# EAGLE design Płytka (EAGLE 9.5.1)
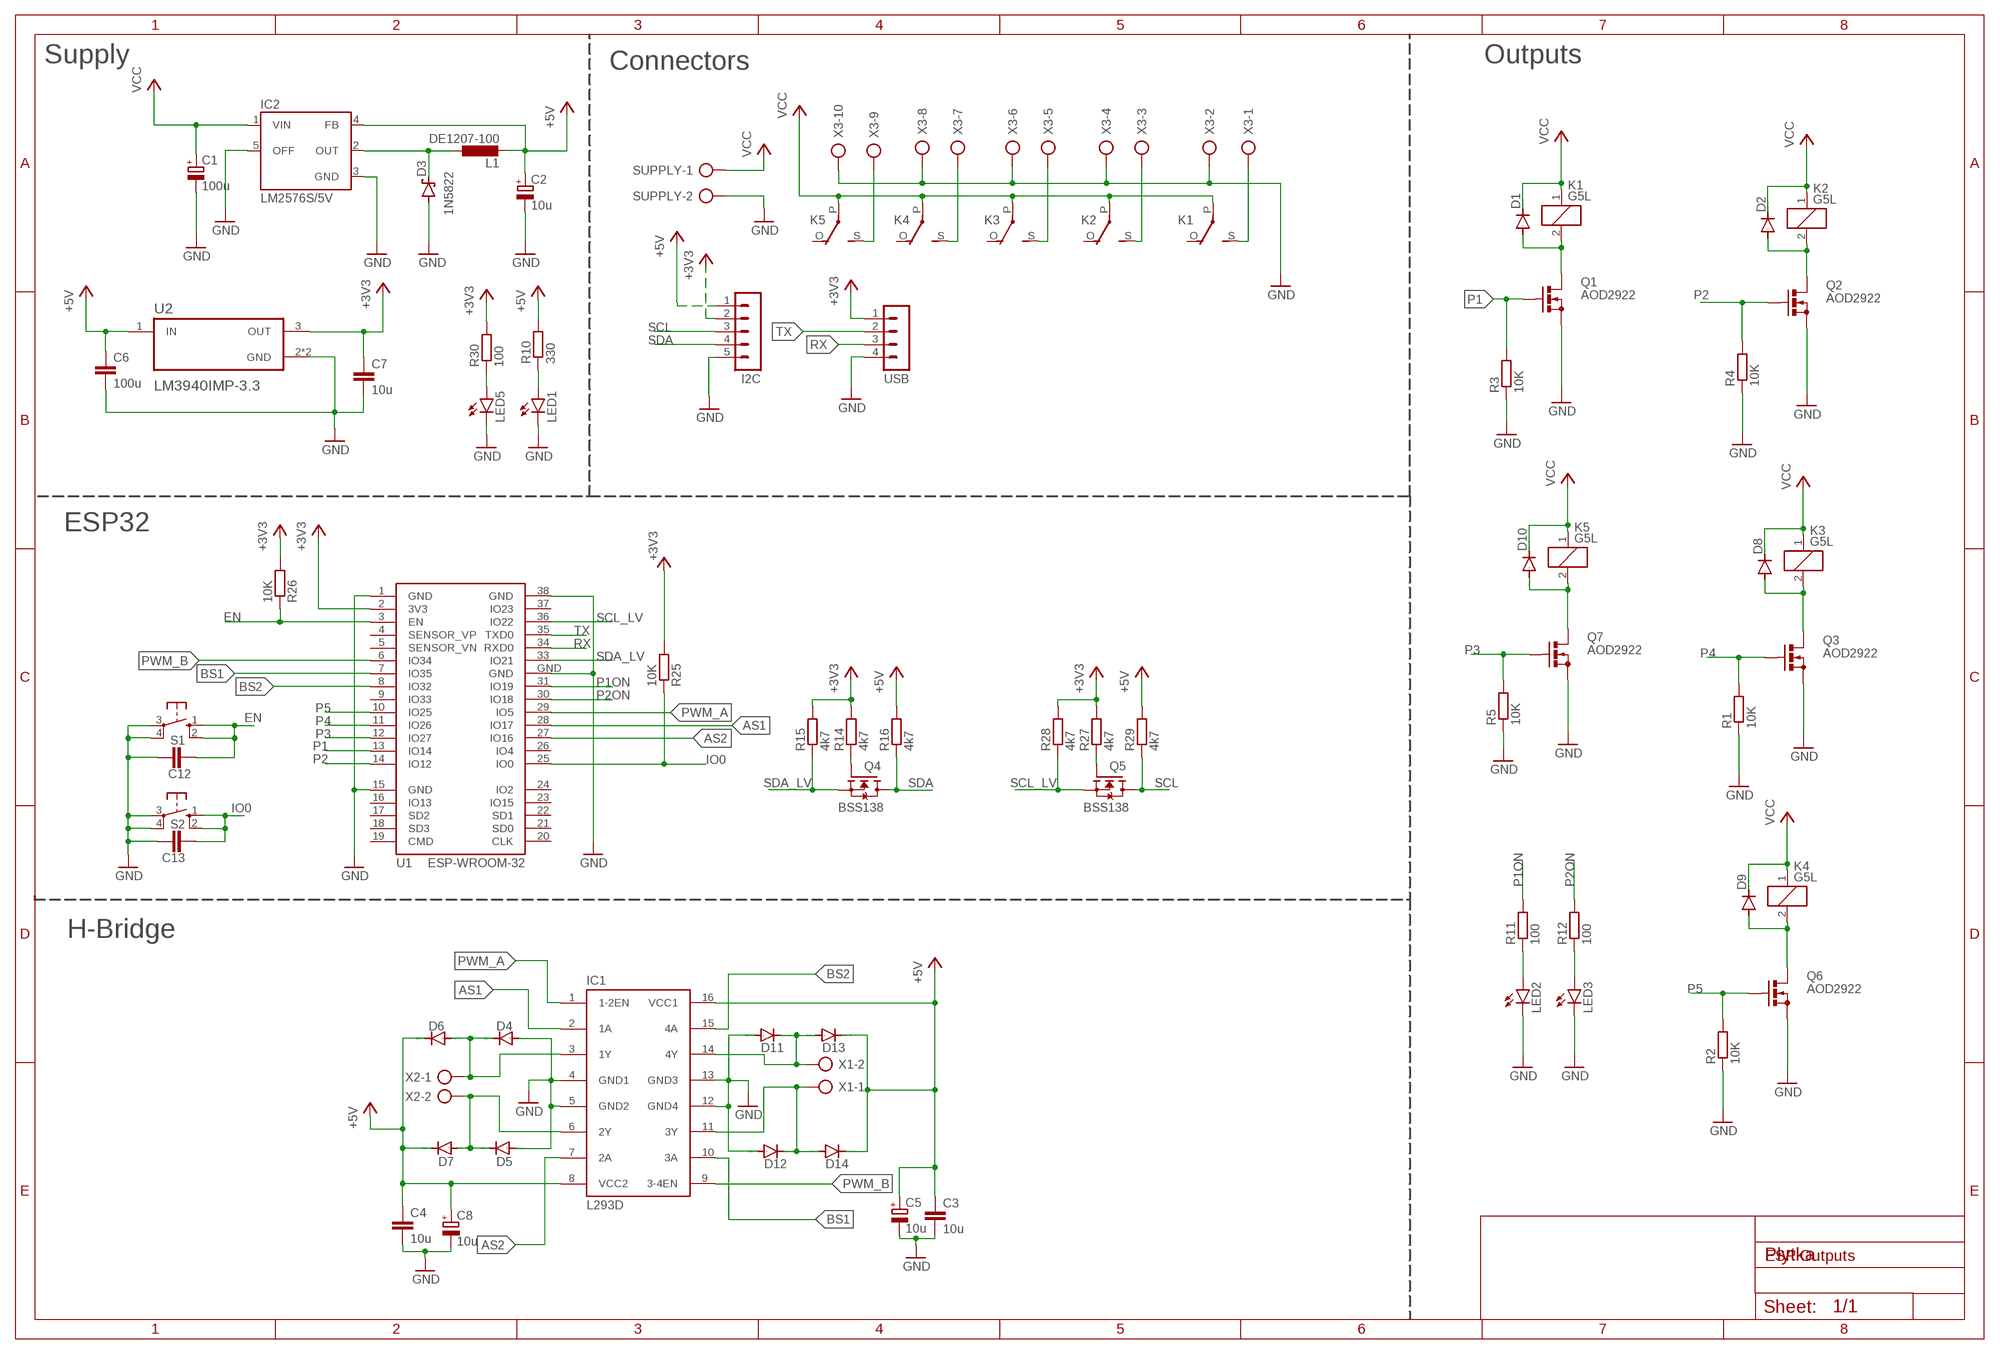
[diagram p0: schematic, sheet 1]

## Parts
C1  100u  CPOL-EUE2.5-6  [E2,5-6]
C2  10u  CPOL-EUE3.5-8  [E3,5-8]
C3  10u  C-EUC0805K  [C0805K]
C4  10u  C-EUC0805K  [C0805K]
C5  10u  CPOL-EUE5-8.5  [E5-8,5]
C6  100u  C-EUC0805K  [C0805K]
C7  10u  C-EUC0805K  [C0805K]
C8  10u  CPOL-EUE5-8.5  [E5-8,5]
C12  C-EUC0805K  [C0805K]
C13  C-EUC0805K  [C0805K]
D1  DIODE-DO214AC  [DO214AC]
D2  DIODE-DO214AC  [DO214AC]
D3  1N5822  1N5908  [C4111-15]
D4  DIODE-DO214AC  [DO214AC]
D5  DIODE-DO214AC  [DO214AC]
D6  DIODE-DO214AC  [DO214AC]
D7  DIODE-DO214AC  [DO214AC]
D8  DIODE-DO214AC  [DO214AC]
D9  DIODE-DO214AC  [DO214AC]
D10  DIODE-DO214AC  [DO214AC]
D11  DIODE-DO214AC  [DO214AC]
D12  DIODE-DO214AC  [DO214AC]
D13  DIODE-DO214AC  [DO214AC]
D14  DIODE-DO214AC  [DO214AC]
I2C  MA05-1  [MA05-1]
IC1  L293D  [DIL16]
IC2  LM2576S/5V  LM2576T  [TO220-5]
K1  G5L  [G5LE]
K2  G5L  [G5LE]
K3  G5L  [G5LE]
K4  G5L  [G5LE]
K5  G5L  [G5LE]
L1  DE1207-100  [DE1207]
LED1  LEDSML0805  [SML0805]
LED2  LEDSML0805  [SML0805]
LED3  LEDSML0805  [SML0805]
LED5  LEDSML0805  [SML0805]
Q1  AOD2922  MOSFET_NIXTY8N65X2  [TO252AA]
Q2  AOD2922  MOSFET_NIXTY8N65X2  [TO252AA]
Q3  AOD2922  MOSFET_NIXTY8N65X2  [TO252AA]
Q4  BSS138  [SOT23]
Q5  BSS138  [SOT23]
Q6  AOD2922  MOSFET_NIXTY8N65X2  [TO252AA]
Q7  AOD2922  MOSFET_NIXTY8N65X2  [TO252AA]
R1  10K  R-EU_R0805  [R0805]
R2  10K  R-EU_R0805  [R0805]
R3  10K  R-EU_R0805  [R0805]
R4  10K  R-EU_R0805  [R0805]
R5  10K  R-EU_R0805  [R0805]
R10  330  R-EU_R0805  [R0805]
R11  100  R-EU_R0805  [R0805]
R12  100  R-EU_R0805  [R0805]
R14  4k7  R-EU_R0805  [R0805]
R15  4k7  R-EU_R0805  [R0805]
R16  4k7  R-EU_R0805  [R0805]
R25  10K  R-EU_R0805  [R0805]
R26  10K  R-EU_R0805  [R0805]
R27  4k7  R-EU_R0805  [R0805]
R28  4k7  R-EU_R0805  [R0805]
R29  4k7  R-EU_R0805  [R0805]
R30  100  R-EU_R0805  [R0805]
S1  10-XX  [B3F-10XX]
S2  10-XX  [B3F-10XX]
SUPPLY  AK500/2-H  [AK500/2-H]
U1  ESP-WROOM-32  [ESP-WROOM-32]
U2  LM3940IMP-3.3  [SOT230P700X180-4N]
USB  MA04-1  [MA04-1]
X1  AK500/2  [AK500/2]
X2  AK500/2  [AK500/2]
X3  AK500/10  [AK500/10]

## Nets
+3V3: C7.1 I2C.2 R14.2 R15.2 R25.2 R26.2 R27.2 R28.2 R30.2 U1.2(3V3) U2.3(OUT) USB.1
+5V: C2.+ C3.1 C4.1 C5.+ C6.1 C8.+ D6.C D7.C D13.C D14.C I2C.1 IC1.8(VCC2) IC1.16(VCC1) IC2.4(FB) L1.2 R10.2 R16.2 R29.2 U2.1(IN)
AS1: IC1.2(1A) U1.28(IO17)
AS2: IC1.7(2A) U1.27(IO16)
BS1: IC1.10(3A) U1.7(IO35)
BS2: IC1.15(4A) U1.8(IO32)
EN: C12.2 R26.1 S1.1(S) S1.2(S1) U1.3(EN)
GND: C1.- C2.- C3.2 C4.2 C5.- C6.2 C7.2 C8.- C12.1 C13.1 D3.A D4.A D5.A D11.A D12.A I2C.5 IC1.4(GND1) IC1.5(GND2) IC1.12(GND4) IC1.13(GND3) IC2.3(GND) IC2.5(OFF) LED1.C LED2.C LED3.C LED5.C Q1.2(S) Q2.2(S) Q3.2(S) Q6.2(S) Q7.2(S) R1.1 R2.1 R3.1 R4.1 R5.1 S1.3(P) S1.4(P1) S2.3(P) S2.4(P1) SUPPLY.2 U1.1(GND) U1.15(GND) U1.38(GND) U1.GND U2.2(GND) U2.4(GND) USB.4 X3.2 X3.4 X3.6 X3.8 X3.10
IO0: C13.2 R25.1 S2.1(S) S2.2(S1) U1.25(IO0)
N$1: K5.S(2:S) X3.9
N$2: D8.A K3.2 Q3.3(D)
N$3: LED1.A R10.1
N$4: Q4.1(G) R14.1
N$5: LED2.A R11.1
N$6: LED3.A R12.1
N$7: K4.S(2:S) X3.7
N$8: Q5.1(G) R27.1
N$9: K3.S(2:S) X3.5
N$10: K2.S(2:S) X3.3
N$11: D9.A K4.2 Q6.3(D)
N$12: D1.A K1.2 Q1.3(D)
N$13: D2.A K2.2 Q2.3(D)
N$14: K1.S(2:S) X3.1
N$16: D10.A K5.2 Q7.3(D)
N$18: D4.C D6.A IC1.3(1Y) X2.1
N$19: D3.C IC2.2(OUT) L1.1
N$20: D12.C D14.A IC1.11(3Y) X1.1
N$21: D11.C D13.A IC1.14(4Y) X1.2
N$23: LED5.A R30.1
N$24: D5.C D7.A IC1.6(2Y) X2.2
P1: Q1.1(G) R3.2 U1.13(IO14)
P1ON: R11.2 U1.31(IO19)
P2: Q2.1(G) R4.2 U1.14(IO12)
P2ON: R12.2 U1.30(IO18)
P3: Q7.1(G) R5.2 U1.12(IO27)
P4: Q3.1(G) R1.2 U1.11(IO26)
P5: Q6.1(G) R2.2 U1.10(IO25)
PWM_A: IC1.1(1-2EN) U1.29(IO5)
PWM_B: IC1.9(3-4EN) U1.6(IO34)
RX: U1.34(RXD0) USB.3
SCL: I2C.3 Q5.3(D) R29.1
SCL_LV [U1]: Q5.2(S) R28.1 U1.36(IO22)
SDA: I2C.4 Q4.3(D) R16.1
SDA_LV [U1]: Q4.2(S) R15.1 U1.33(IO21)
TX: U1.35(TXD0) USB.2
VCC: C1.+ D1.C D2.C D8.C D9.C D10.C IC2.1(VIN) K1.1 K1.P(2:P) K2.1 K2.P(2:P) K3.1 K3.P(2:P) K4.1 K4.P(2:P) K5.1 K5.P(2:P) SUPPLY.1
Unconnected: K1.O(2:O) K2.O(2:O) K3.O(2:O) K4.O(2:O) K5.O(2:O) U1.4(SENSOR_VP) U1.5(SENSOR_VN) U1.9(IO33) U1.16(IO13) U1.17(SD2) U1.18(SD3) U1.19(CMD) U1.20(CLK) U1.21(SD0) U1.22(SD1) U1.23(IO15) U1.24(IO2) U1.26(IO4) U1.37(IO23)

## Notes on the sheet
- Supply | Connectors | Outputs
- ESP32
- H-Bridge
- ESP Outputs

## Library data of the parts
C1 C2 = rcl:CPOL-EU: POLARIZED CAPACITOR, European symbol; SPICEPREFIX: C
C3 C4 = resistor:C-EU: CAPACITOR, European symbol
C5 C8 = resistor:CPOL-EU: POLARIZED CAPACITOR, European symbol
C6 C7 C12 C13 = rcl:C-EU: CAPACITOR, European symbol; SPICEPREFIX: C
D1 D2 D4-D14 = diode:DIODE-: DIODE
D3 = diode:1N5908: DIODE schottky
I2C = con-lstb:MA05-1: PIN HEADER; OC_FARNELL: unknown; OC_NEWARK: unknown
IC1 = st-microelectronics:L293D: PUSH-PULL 4 CHANNEL DRIVER
IC2 = v-reg-3:LM2576: National Semiconductor <http://www.national.com> 3.0A "Simple Switcher"(c) 52kHz, Vout 1.23-37V (HV: 57V), Vin 40V (HV: 60V), 50µA standby current
K1-K5 = relay:G5L: RELAY 1 x switch, 10 A/120 V AC, 8 A/30 V ADC, Omron; OC_FARNELL: unknown; OC_NEWARK: unknown
L1 = ferrocore:DE1207-100: SMD power coil 100 uH
LED1-LED3 LED5 = led:LED: LED OSRAM: - CHIPLED LG R971, LG N971, LY N971, LG Q971, LY Q971, LO R971, LY R971 LH N974, LH R974 LS Q976, LO Q976, LY Q976 LO Q996 - Hyper CHIPLED LW Q18S LB Q993, LB Q99A, LB R99A - SideLED LS A670, LO A670, LY A670, LG A670, LP A670 LB A673, LV A673, LT A673, LW A673 LH A674 LY A675 LS A676, LA A676, LO A676, LY A676, LW A676 LS A679, LY A679, LG A679 - Hyper Micro SIDELED® LS Y876, LA Y876, LO Y876, LY Y876 LT Y87S - SmartLED LW L88C, LW L88S LB L89C, LB L89S, LG L890 LS L89K, LO L89K, LY L89K LS L896, LA L896, LO L896, LY L896 - TOPLED LS T670, LO T670, LY T670, LG T670, LP T670 LSG T670, LSP T670, LSY T670, LOP T670, LYG T670 LG T671, LOG T671, LSG T671 LB T673, LV T673, LT T673, LW T673 LH T674 LS T676, LA T676, LO T676, LY T676, LB T676, LH T676, LSB T676, LW T676 LB T67C, LV T67C, LT T67C, LS T67K, LO T67K, LY T67K, LW E67C LS E67B, LA E67B, LO E67B, LY E67B, LB E67C, LV E67C, LT E67C LW T67C LS T679, LY T679, LG T679 LS T770, LO T770, LY T770, LG T770, LP T770 LB T773, LV T773, LT T773, LW T773 LH T774 LS E675, LA E675, LY E675, LS T675 LS T776, LA T776, LO T776, LY T776, LB T776 LHGB T686 LT T68C, LB T68C - Hyper Mini TOPLED® LB M676 - Mini TOPLED Santana® LG M470 LS M47K, LO M47K, LY M47K Source: http://www.osram.convergy.de LUXEON: - LUMILED® LXK2-PW12-R00, LXK2-PW12-S00, LXK2-PW14-U00, LXK2-PW14-V00 LXK2-PM12-R00, LXK2-PM12-S00, LXK2-PM14-U00 LXK2-PE12-Q00, LXK2-PE12-R00, LXK2-PE12-S00, LXK2-PE14-T00, LXK2-PE14-U00 LXK2-PB12-K00, LXK2-PB12-L00, LXK2-PB12-M00, LXK2-PB14-N00, LXK2-PB14-P00, LXK2-PB14-Q00 LXK2-PR12-L00, LXK2-PR12-M00, LXK2-PR14-Q00, LXK2-PR14-R00 LXK2-PD12-Q00, LXK2-PD12-R00, LXK2-PD12-S00 LXK2-PH12-R00, LXK2-PH12-S00 LXK2-PL12-P00, LXK2-PL12-Q00, LXK2-PL12-R00 Source: www.luxeon.com KINGBRIGHT: KA-3528ASYC Source: www.kingbright.com
Q1-Q3 Q6 Q7 = Clean-Kong:MOSFET_N: SC70FL MOSFET Canal N, 20V 2A RS920-9805 Canal N : 3=S 2=G 1=D
Q4 Q5 = bss138_10:BSS138: BSS138 N-Channel Logic Level Enhancement Mode Field Effect Transistor Source: http://www.fairchildsemi.com/datasheets/BS/BSS138.pdf; MF: Fairchild; MPN: BSS138; OC_FARNELL: 9845330; OC_NEWARK: 67R2009
R1-R5 R10-R12 R14-R16 R25-R30 = rcl:R-EU_: RESISTOR, European symbol; SPICEPREFIX: R
S1 S2 = switch-omron:10-XX: OMRON SWITCH; MPN: B3F-1000; OC_FARNELL: 176432; OC_NEWARK: 36M3542
SUPPLY = con-ptr500:AK500/2-H: CONNECTOR Aug. 2004 / PTR Meßtechnik: Die Bezeichnung der Serie AK505 wurde geändert. Es handelt sich hierbei um AK500 in horizontaler Ausführung.; OC_FARNELL: unknown; OC_NEWARK: unknown
U1 = esp32:ESP-WROOM-32: Espressif Systems ESP-WROOM-32
U2 = LM3940IMP-3.3:LM3940IMP-3.3: Check prices <https://pricing.snapeda.com/search/part/LM3940IMP-3.3/?ref=eda>; AVAILABILITY: Warning; DESCRIPTION: 1-A, low-dropout voltage regulator for 5-V to 3.3-V conversion 4-SOT-223 -40 to 125; MF: Texas Instruments; MP: LM3940IMP-3.3; PACKAGE: SOT-223-4 Texas Instruments; PRICE: None; PURCHASE-URL: https://pricing.snapeda.com/search/part/LM3940IMP-3.3/?ref=eda
USB = con-lstb:MA04-1: PIN HEADER; OC_FARNELL: unknown; OC_NEWARK: unknown
X1 X2 = con-ptr500:AK500/2: CONNECTOR; OC_FARNELL: unknown; OC_NEWARK: unknown
X3 = con-ptr500:AK500/10: CONNECTOR; OC_FARNELL: unknown; OC_NEWARK: unknown

## Net classes
1 U1: width 0.203 mm

## Board
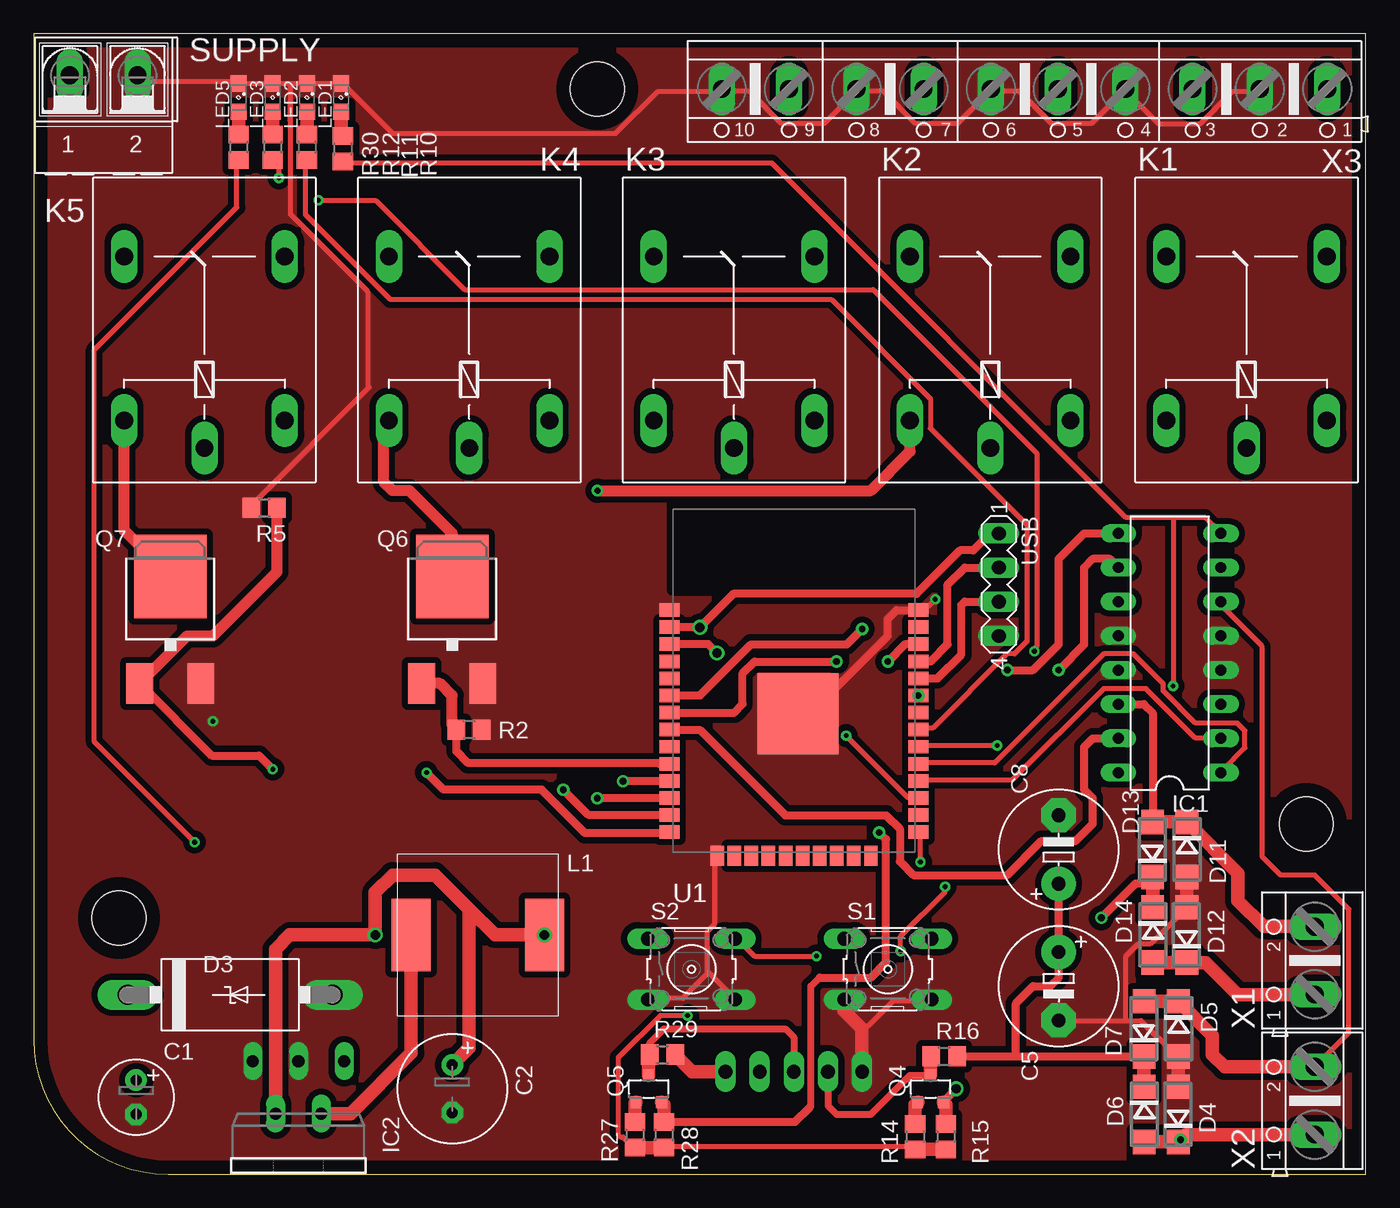
[diagram p1: board, top side]
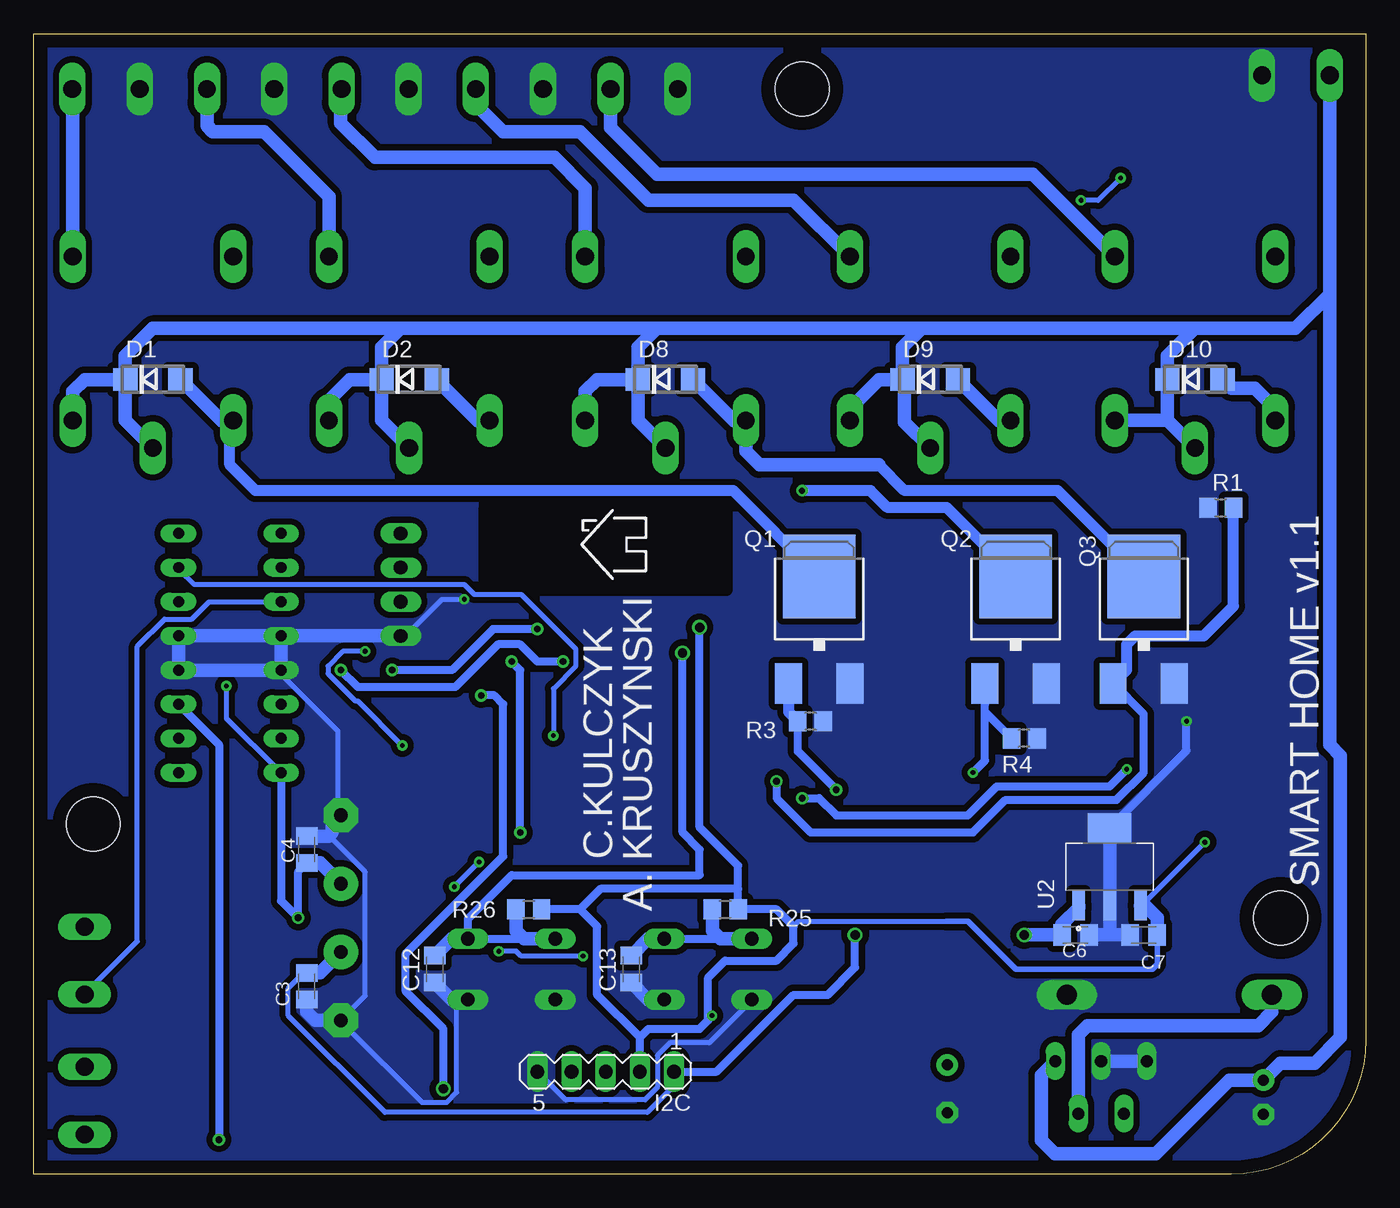
[diagram p2: board, bottom side, seen from below]

Size 99.04 x 84.76 mm. Coordinates in mm from the lower left corner, seen from the top.
Outline: 10,0 99.04,0 99.04,84.76 0,84.76 0,10 arc90 10,0
Copper layers (1*16): Top 0.035mm / dielectric 1.5mm / Bottom 0.035mm
Design rules "default *": minimum track width 14mil, minimum drill 0.35mm, track to track 15mil, track to pad 10mil, pad to pad 6mil, via to via 6mil, smd to smd 6mil, copper to edge 40mil, drill to drill 6mil, minimum pad ring 10mil, minimum via ring 8mil, stop-mask expansion 4mil, vias tented up to drill 0mil, thermal gap 10mil
Holes 4.01 mm at 41.91,80.64 94.61,26.04 6.35,19.05

### Footprints (pad centres in the part's own frame; a part is rotated, then mirrored left to right if it is on the bottom)
E2,5-6 = drill 0.813 pad 1.6: + -1.27,0 | drill 0.813 pad 1.6 octagon: - 1.27,0
E3,5-8 = drill 0.813 pad 1.6: + -1.778,0 | drill 0.813 pad 1.6 octagon: - 1.778,0
C0805K = smd 1.3 x 1.6: 1 -1,0; 2 1,0
E5-8,5 = drill 1.016 pad 2.54: + -2.54,0 | drill 1.016 pad 2.54 octagon: - 2.54,0
DO214AC = smd 1.8 x 1.7: A 2.05,0; C -2.05,0
C4111-15 = drill 1.499 long: A 7.62,0; C -7.62,0
MA05-1 = drill 1.016 long: 1 -5.08,0; 2 -2.54,0; 3 0,0; 4 2.54,0; 5 5.08,0
DIL16 = drill 0.813 long: 1 -8.89,-3.81; 2 -6.35,-3.81; 3 -3.81,-3.81; 4 -1.27,-3.81; 5 1.27,-3.81; 6 3.81,-3.81; 7 6.35,-3.81; 8 8.89,-3.81; 9 8.89,3.81; 10 6.35,3.81; 11 3.81,3.81; 12 1.27,3.81; 13 -1.27,3.81; 14 -3.81,3.81; 15 -6.35,3.81; 16 -8.89,3.81
TO220-5 = drill 0.9 long: 1 -3.4,-8.4; 2 -1.7,-4.5; 3 0,-8.4; 4 1.7,-4.5; 5 3.4,-8.4
G5LE = drill 1.321 long: 1 -7.493,-5.969; 2 -7.493,5.969; O 4.699,5.969; P -9.525,0; S 4.699,-5.969
DE1207 = smd 2.9 x 5.4: 1 -4.95,0; 2 4.95,0
SML0805 = smd 1.2 x 1.2: A 1.05,0; C -1.05,0
TO252AA = smd 2 x 3: 1 -2.28,-2.895; 2 2.28,-2.895 | smd 5.4 x 6.2: 3 0,5.04
SOT23 = smd 0.8 x 0.9: 1 -0.95,-1; 2 0.95,-1; 3 0,1
R0805 = smd 1.3 x 1.5: 1 -0.95,0; 2 0.95,0
B3F-10XX = drill 1.016 long: 1 -3.251,2.261; 2 3.251,2.261; 3 -3.251,-2.261; 4 3.251,-2.261
AK500/2-H = drill 1.321 long: 1 -2.515,0; 2 2.515,0
ESP-WROOM-32 = smd 1.5 x 1: 1 -9.25,7; 2 -9.25,5.73; 3 -9.25,4.46; 4 -9.25,3.19; 5 -9.25,1.92; 6 -9.25,0.65; 7 -9.25,-0.62; 8 -9.25,-1.89; 9 -9.25,-3.16; 10 -9.25,-4.43; 11 -9.25,-5.7; 12 -9.25,-6.97; 13 -9.25,-8.24; 14 -9.25,-9.51; 25 9.25,-9.51; 26 9.25,-8.24; 27 9.25,-6.97; 28 9.25,-5.7; 29 9.25,-4.43; 30 9.25,-3.16; 31 9.25,-1.89; 32 9.25,-0.62; 33 9.25,0.65; 34 9.25,1.92; 35 9.25,3.19; 36 9.25,4.46; 37 9.25,5.73; 38 9.25,7 | smd 1 x 1.5: 15 -5.7,-11.25; 16 -4.43,-11.25; 17 -3.16,-11.25; 18 -1.89,-11.25; 19 -0.62,-11.25; 20 0.65,-11.25; 21 1.92,-11.25; 22 3.19,-11.25; 23 4.46,-11.25; 24 5.73,-11.25 | smd 6 x 6: GND 0.3,-0.7
SOT230P700X180-4N = smd 2.15 x 0.95: 1 -2.9,2.3; 2 -2.9,0; 3 -2.9,-2.3 | smd 2.15 x 3.25: 4 2.9,0
MA04-1 = drill 1.016 long: 1 -3.81,0; 2 -1.27,0; 3 1.27,0; 4 3.81,0
AK500/2 = drill 1.321 long: 1 -2.515,0; 2 2.515,0
AK500/10 = drill 1.321 long: 1 -22.504,0; 2 -17.501,0; 3 -12.497,0; 4 -7.493,0; 5 -2.489,0; 6 2.489,0; 7 7.493,0; 8 12.497,0; 9 17.501,0; 10 22.504,0

### Placement (x,y rotation side)
C1  7.62,5.71 270 top
C2  31.11,6.35 270 top
C3  78.74,13.97 270 bottom
C4  78.74,24.13 90 bottom
C5  76.2,13.97 270 top
C6  21.59,17.78 0 bottom
C7  16.51,17.78 180 bottom
C8  76.2,24.13 90 top
C12  69.22,15.24 90 bottom
C13  54.61,15.24 90 bottom
D1  90.17,59.05 0 bottom
D2  71.12,59.05 0 bottom
D3  14.61,13.34 0 top
D4  85.09,4.45 90 top
D5  85.09,10.79 270 top
D6  82.55,4.45 270 top
D7  82.55,10.79 90 top
D8  52.07,59.05 0 bottom
D9  32.38,59.05 0 bottom
D10  12.7,59.05 0 bottom
D11  85.72,24.13 270 top
D12  85.72,17.78 90 top
D13  83.19,24.13 90 top
D14  83.19,17.78 270 top
I2C  56.52,7.62 180 bottom
IC1  84.45,38.73 90 top
IC2  19.68,0 180 top
K1  90.17,63.5 90 top
K2  71.12,63.5 90 top
K3  52.07,63.5 90 top
K4  32.38,63.5 90 top
K5  12.7,63.5 90 top
L1  33.02,17.78 0 top
LED1  22.86,80.01 270 top
LED2  20.32,80.01 270 top
LED3  17.78,80.01 270 top
LED5  15.24,80.01 270 top
Q1  40.64,39.37 0 bottom
Q2  26.04,39.37 0 bottom
Q3  16.51,39.37 0 bottom
Q4  66.67,6.35 0 top
Q5  45.72,6.35 0 top
Q6  31.11,39.37 0 top
Q7  10.16,39.37 0 top
R1  10.79,49.53 0 bottom
R2  32.38,33.02 180 top
R3  41.27,33.66 180 bottom
R4  25.4,32.38 180 bottom
R5  17.14,49.53 0 top
R10  22.99,76.2 270 top
R11  20.32,76.33 270 top
R12  17.78,76.33 270 top
R14  65.53,2.79 270 top
R15  67.82,2.79 270 top
R16  67.69,8.76 0 top
R25  47.62,19.68 0 bottom
R26  62.23,19.68 0 bottom
R27  44.7,2.92 270 top
R28  46.86,2.92 270 top
R29  46.74,8.89 0 top
R30  15.24,76.33 270 top
S1  63.5,15.24 0 top
S2  48.9,15.24 0 top
SUPPLY  5.21,81.66 0 top
U1  56.52,34.92 0 top
U2  19.05,22.86 90 bottom
USB  71.75,43.81 270 top
X1  95.25,15.88 90 top
X2  95.25,5.46 90 top
X3  73.66,80.64 180 top

### Tracks (layer width: path | path; a pad name or v marks a point on that pad's centre or on a via)
+3V3  (via drill 0.35, 0.7)
  Top 0.356: R28.2 47.33,2.03 65.19,2.03 R14.2 | v48.62,11.79 46.59,11.79 43.46,8.65 43.46,2.95 43.64,2.76 43.83,2.76 44.38,2.21 R27.2 | v11.97,24.68 4.52,32.12 4.52,61.27 15.1,71.84 15.1,75.32 R30.2
  Top 0.61: USB.1 71.12,47.62 69.85,46.35 68.88,46.35 65.64,43.12 52.01,43.12 v49.53,40.64 47.28,40.64 U1.2
  Top 1.016: R27.2 R28.2 | R14.2 R15.2
  Bottom 0.356: v48.62,11.79 48.9,11.79 | v11.97,24.68 16.2,20.44 16.4,19.96 | 31.19,18.78 42.16,18.78 42.55,18.41
  Bottom 0.406: 31.19,18.78 29.58,18.78 26.04,15.24 15.88,15.24 15.51,15.61 C7.1
  Bottom 0.61: I2C.2 53.98,10.16 | 58.42,19.68 57.15,18.41 57.15,13.34 53.98,10.16 | 58.42,19.68 R26.2 | 53.98,10.16 53.34,10.79 49.53,10.79 48.9,11.43 48.9,11.79 48.9,14.61 47.62,15.88 43.81,15.88 42.55,17.14 42.55,18.41 43.81,19.68 R25.2 46.67,21.21 | 46.67,21.21 46.67,22.93 49.53,25.78 v49.53,40.64 | 46.67,21.21 56.9,21.21 58.42,19.68
  Bottom 1.016: C7.1 15.51,19.07 16.4,19.96 U2.3
+5V  (via drill 0.35, 0.5, 0.7)
  Top 0.356: 84.71,48.8 87.1,48.8 88.21,47.7 IC1.8 | 84.71,48.8 81.21,48.8 54.88,75.13 23.02,75.13 R10.2 | 84.71,48.8 v84.71,36.28
  Top 0.61: R16.2 73.03,8.76 | 73.03,8.76 82.53,8.76 D7.C | 73.03,8.76 73.03,12.7 74.3,13.97 75.56,13.97 76.2,14.61 C5.+ C8.+ | D13.C 82.69,21.59 81.92,21.59 v79.38,19.05
  Top 1.016: D6.C D7.C | D14.C D13.C | 32.38,19.68 29.84,22.23 26.67,22.23 25.4,20.95 v25.4,17.78 19.05,17.78 17.98,16.71 IC2.4 | 32.38,19.68 34.29,17.78 L1.2 | R29.2 48.96,7.62 I2C.1 | C2.+ 32.38,9.4 32.38,19.68
  Bottom 0.356: C3.1 79.18,14.73 80.11,13.81 80.11,11.79 72.92,4.6 53.4,4.6 51.56,6.45 51.56,7.37 I2C.1 | v84.71,36.28 84.71,33.88 80.84,30.02 IC1.16
  Bottom 0.61: I2C.1 48.26,7.62 42.55,13.34 40.01,13.34 37.97,15.37 L1.2 | IC1.16 80.64,20.32 v79.38,19.05 79.38,22.5 C4.1
  Bottom 1.016: C8.+ 77.74,23.13 C4.1 | C5.+ 77.74,14.97 C3.1 | U2.1 21.35,19.8 22.59,18.56 C6.1 v25.4,17.78
  other vias: 37.97,17.78
AS1
  Top 0.356: U1.28 65.93,29.28 72.74,29.28 79.55,36.09 82.68,36.09 86.37,32.41 88.21,32.41 IC1.2
AS2  (via drill 0.35)
  Top 0.356: v60.4,32.59 65,27.99 65.74,27.99 U1.27
  Bottom 0.356: v60.4,32.59 60.4,36.09 58.74,37.75 58.74,39.04 62.8,43.09 66.29,43.09 67.03,43.83 87.1,43.83 88.21,44.93 IC1.7
BS1  (via drill 0.5)
  Top 0.61: U1.7 52.09,34.3 52.7,34.92 52.7,37.21 53.59,38.1 v59.69,38.1 | v76.2,37.47 78.11,39.37 78.11,45.09 78.74,45.72 80.01,45.72 IC1.10
  Bottom 0.61: v59.69,38.1 61.59,38.1 62.87,39.37 64.52,39.37 67.69,36.2 74.93,36.2 v76.2,37.47
BS2
  Top 0.61: U1.8 49.53,33.02 55.88,26.67 63.37,26.67 64.39,25.65 64.39,23.24 65.41,22.23 72.39,22.23 74.93,24.77 77.47,24.77 78.74,26.04 78.74,27.94 78.11,28.57 78.11,31.75 78.74,32.38 IC1.15
EN  (via drill 0.7)
  Top 0.61: U1.3 50.15,39.38 v50.8,38.73
  Bottom 0.61: 62.59,17.5 S1.2 66.75,18.97 63.5,22.23 49.53,22.23 49.53,24.13 50.8,25.4 v50.8,38.73
  Bottom 1.016: C12.2 67.95,17.5 S1.2 | R26.1 63.18,18.09 62.59,17.5 S1.1
GND  (via drill 0.35)
  Top 0.356: S1.4 66.66,12.89 63.9,12.89 62.06,11.05 61.59,10.79 | 81.21,11.42 76.24,11.42 C5.- | 81.21,11.42 82.31,11.42 84.71,9.02 D5.A | 81.21,11.42 81.21,16.2 82.13,17.13 83.05,17.13 85.45,19.52 D12.A | v67.03,42.72 66.48,42.17 65.93,42.17 U1.38 | 50.18,15.01 52.11,13.07 S2.4 | 50.18,15.01 50.09,15.1 50.09,18.05 50.64,18.6 50.64,23.57 U1.15 | 50.18,15.01 48.25,13.07 45.67,13.07 S2.3 45.48,12.89 | X3.2 91.15,80.47 89.13,80.47 86.73,78.08 83.6,78.08 81.21,80.47 X3.4 81.03,80.47 78.63,78.08 75.69,78.08 73.29,80.47 71.27,80.47 X3.6 71.08,80.47 68.69,78.08 65.56,78.08 63.16,80.47 61.32,80.47 X3.8 61.14,80.47 58.74,78.08 55.61,78.08 53.22,80.47 51.19,80.47 X3.10 51.01,80.47 46.41,80.47 43.27,77.34 26.7,77.34 23.02,81.03 LED1.C 22.84,81.03 20.44,81.03 LED2.C 20.26,81.03 19.09,81.03 | 19.09,81.03 17.86,81.03 LED3.C 17.68,81.03 15.28,81.03 LED5.C 15.1,81.21 8.1,81.21 7.73,81.58 SUPPLY.2 | R5.1 16.39,49.91 24.95,58.47 24.86,58.56 24.86,65.57 19.09,71.34 19.09,81.03
  Top 0.61: U1.GND 57.72,34.23 63.5,40.01 63.5,41.27 64.15,41.92 U1.38
  Top 1.016: D4.A D5.A | D12.A D11.A | I2C.5 61.59,10.79 60.25,12.14 S1.3
  Bottom 0.356: C8.- 76.42,27.07 76.42,32.96 80.47,37.01 IC1.13 | S1.4 67.58,12.52 67.58,6.08 68.32,5.34 70.16,5.34 75.87,11.05 C5.- 75.87,11.79 74.4,13.26 74.4,22.47 76.79,24.86 77.11,25.13 | v67.03,42.72 68.69,42.72 71.27,40.15 USB.4 | I2C.5 61.51,7.55 59.48,5.52 53.59,5.52 52.67,6.45 52.67,8.84 51.75,9.76 48.8,9.76 45.67,12.89 S2.3 | 18.6,25.96 U2.4
  Bottom 0.61: U2.4 13.34,31.48 v13.34,33.66
  Bottom 1.016: C8.- 76.83,26.04 76.83,25.4 77.11,25.13 C4.2 | C5.- 78.11,11.43 78.74,12.06 C3.2 | C12.1 67.95,12.98 S1.4 | C13.1 53.35,12.98 S2.4 | C7.2 19.05,17.78 | 19.05,17.78 C6.2 | 19.05,17.78 U2.2 U2.4 | IC1.12 IC1.13 IC1.4 IC1.5 IC1.12 | IC1.12 USB.4 | IC2.3 IC2.5
  pour Bottom (isolate 0.457, no thermals): -14.61,99.06 -14.61,10.16 8.26,-12.7 97.79,-12.7 109.22,-1.27 109.22,90.81 100.97,99.06
  pour Top (isolate 0.457, no thermals): 34.29,103.5 10.79,103.5 -10.16,82.55 -10.16,6.35 6.99,-10.79 96.52,-10.79 97.16,-10.16 113.67,6.35 113.67,26.67 113.67,91.44 102.23,102.87 34.92,102.87
IO0  (via drill 0.35)
  Top 0.356: v65.93,23.2 65.93,25.41 U1.25 | v67.77,21.36 67.77,20.99 64.45,17.68 v64.45,16.57 | v58.19,16.2 53.59,16.2 52.3,17.49 S2.2
  Bottom 0.356: v67.77,21.36 v65.93,23.2 | v64.45,16.57 63.16,16.57 62.8,16.2 v58.19,16.2
  Bottom 0.61: S2.2 47.98,17.5
  Bottom 1.016: C13.2 53.35,17.5 S2.2 | R25.1 48.58,18.09 47.98,17.5 S2.1
N$1
  Bottom 1.016: K5.S 24.77,74.3 52.7,74.3 56.16,77.75 X3.9
N$2
  Bottom 0.813: Q3.3 22.9,50.8 34.29,50.8 36.2,52.7
  Bottom 1.016: D8.A 46.97,56.01 K3.2 46.1,53.72 45.09,52.7 36.2,52.7
N$3
  Top 1.016: R10.1 22.86,77.28 LED1.A
N$4
  Top 1.016: R14.1 65.53,5.16 Q4.1
N$5
  Top 1.016: R11.1 LED2.A
N$6
  Top 1.016: R12.1 LED3.A
N$7
  Bottom 1.016: K4.S 42.55,72.39 53.34,72.39 58.42,77.47 64.14,77.47 66.17,79.5 X3.7
N$8
  Top 1.016: R27.1 44.7,5.28 Q5.1
N$9
  Bottom 1.016: K3.S 58.04,73.28 60.33,75.56 73.66,75.56 76.2,78.11 76.2,80.59 X3.5
N$10
  Bottom 1.016: K2.S 77.09,72.64 81.92,77.47 85.72,77.47 86.16,77.9 X3.3
N$11
  Top 0.813: Q6.3 31.11,47.62 27.94,50.8 26.67,50.8 26.04,51.44 26.04,55.63 K4.2
  Bottom 1.016: D9.A 27.29,56.01 K4.2
N$12
  Bottom 0.813: Q1.3 47.03,50.8 82.55,50.8 84.45,52.7 84.45,55.75 K1.2
  Bottom 1.016: D1.A 85.07,56.01 K1.2
N$13  (via drill 0.45)
  Top 0.813: K2.2 65.15,53.72 62.23,50.8 v41.91,50.8
  Bottom 0.813: Q2.3 31.16,49.53 35.56,49.53 36.83,50.8 v41.91,50.8
  Bottom 1.016: D2.A 66.02,56.01 K2.2
N$14
  Bottom 1.016: K1.S 96.14,80.62 X3.1
N$16
  Top 0.813: Q7.3 6.73,47.84 K5.2
  Bottom 1.016: D10.A 10.02,58.42 8.26,58.42 6.73,56.9 K5.2
N$18  (via drill 0.5)
  Top 1.016: D6.A D4.C v85.26,2.56 85.64,2.95 X2.1
  Bottom 0.61: IC1.3 85.26,31.92 v85.26,2.56
N$19
  Top 1.016: IC2.2 23.55,4.5 28.07,9.02 L1.1
  Bottom 1.016: IC2.2 21.39,10.37 20.7,11.05 8,11.05 6.99,12.06 D3.C
N$20
  Top 1.016: D14.A D12.C 87.14,15.73 89.53,13.34 95.22,13.34 X1.1
  Bottom 0.356: IC1.11 80.66,42.54 86,42.54 87.29,41.25 89.31,41.25 91.34,39.22 91.34,17.31 95.21,13.44 X1.1
N$21
  Top 0.61: IC1.14 82.55,34.92 83.19,34.29 D13.A
  Top 1.016: D13.A D11.C 89.53,22.37 89.53,20.32 91.44,18.41 95.22,18.41 X1.2
N$23
  Top 1.016: R30.1 LED5.A
N$24
  Top 0.356: X2.2 97.78,10.51 97.78,19.69 95.25,22.23 92.71,22.23 91.34,23.6 91.34,39.22 88.39,42.17 88.39,42.54 IC1.6
  Top 1.016: D7.A D5.C 87.63,10.3 87.63,8.89 88.54,7.98 X2.2
P1  (via drill 0.5)
  Top 0.61: U1.13 41.26,26.68 v39.37,28.57
  Bottom 0.61: R3.2 42.23,31.43 v39.37,28.57
  Bottom 0.813: Q1.1 42.92,34.35 R3.2
P1ON
  Top 0.356: R11.2 20.19,75.24 20.19,71.34 26.52,65 59.3,65 66.66,57.64 66.66,55.43 73.84,48.25 73.84,39.59 72.92,38.67 72.37,38.67 66.85,33.15 65.93,33.15 U1.31
P2  (via drill 0.35)
  Top 0.61: U1.14 47.2,25.35 40.99,25.35 37.76,28.57 30.48,28.57 v29.21,29.84
  Bottom 0.61: v29.21,29.84 28.32,30.74 28.32,34.35 | Q2.1 28.32,34.92 28.32,34.35 | R4.2 28.32,34.35
P2ON  (via drill 0.35)
  Top 0.356: v71.63,31.86 65.93,31.86 U1.30 | v74.4,38.86 74.4,39.04 74.58,39.22 74.58,53.59 62.43,65.74 32.04,65.74 25.41,72.37 v21.18,72.37 | v18.23,74.03 18.23,74.95 17.86,75.32 R12.2
  Bottom 0.356: v71.63,31.86 74.95,35.17 75.13,35.17 77.16,37.2 77.16,37.75 76.05,38.86 v74.4,38.86 | v21.18,72.37 19.89,72.37 v18.23,74.03
P3  (via drill 0.35, 0.5)
  Top 0.61: U1.12 41.92,27.95 v41.91,27.94 | Q7.1 13.24,31.11 16.76,31.11 v17.78,30.1
  Top 0.813: Q7.1 11.41,40.01 13.34,40.01 18.09,44.77 R5.2
  Bottom 0.61: v41.91,27.94 40.64,27.94 39.37,26.67 29.59,26.67 27.43,28.83 19.05,28.83 v17.78,30.1
P4  (via drill 0.5)
  Top 0.61: U1.11 47.25,29.21 v43.81,29.21
  Bottom 0.61: v43.81,29.21 43.81,27.94 41.27,25.4 29.21,25.4 26.8,27.81 18.54,27.81 16.51,29.84 16.51,34.2 Q3.1
  Bottom 0.813: Q3.1 17.78,37.48 17.78,39.37 17.14,40.01 12.06,40.01 9.85,42.23 R1.2
P5
  Top 0.61: U1.10 46.5,30.5 46.44,30.55 32.31,30.55 31.43,31.43 R2.2
  Top 0.813: R2.2 31.11,33.34 31.11,35.56 30.2,36.48 Q6.1
PWM_A
  Top 0.356: U1.29 65.93,30.57 71.45,30.57 79.55,38.67 81.76,38.67 83.97,36.46 83.97,35.91 86.37,33.52 89.5,33.52 90.05,32.96 90.05,31.67 88.39,30.02 IC1.1
PWM_B  (via drill 0.5)
  Top 0.61: U1.6 49.55,35.58 53.34,39.37 60.45,39.37 v61.59,40.51 | v72.39,37.47 74.3,37.47 76.2,39.37 76.2,45.72 78.11,47.62 IC1.9
  Bottom 0.61: v61.59,40.51 64.9,40.51 67.94,37.47 v72.39,37.47
RX
  Top 0.61: U1.34 67.2,36.84 68.96,38.61 68.96,42.29 69.22,42.55 USB.3
SCL
  Top 0.508: R29.1 45.79,9.72 46.86,10.79 55.88,10.79 56.52,10.16 I2C.3
  Top 1.016: Q5.3 45.72,8.82 R29.1
SCL_LV  (via drill 0.5)
  Top 0.508: 57.73,5.03 57.78,5.08 57.78,13.97 58.42,14.61
  Top 0.61: U1.36 65.75,39.37 64.77,39.37 v63.5,38.1 | 58.42,14.61 62.23,14.61 63.37,15.75 63.37,24.89 v62.87,25.4 | 57.73,5.03 56.58,3.87 R28.1
  Top 1.016: R28.1 46.86,5.16 Q5.2
  Bottom 0.61: v62.87,25.4 62.87,37.47 v63.5,38.1
SDA
  Top 0.508: I2C.4 59.05,5.08 59.69,4.45 62.23,4.45 65.14,7.35 Q4.3
  Top 1.016: Q4.3 66.67,8.7 R16.1
SDA_LV  (via drill 0.5, 0.7)
  Top 0.61: R15.1 67.82,5.59 v68.58,6.35
  Top 1.016: R15.1 67.82,5.16 Q4.2
  Bottom 0.61: v68.58,6.35 68.58,10.79 71.37,13.59 71.37,16.38 64.14,23.62 64.14,34.92 64.78,35.58 v65.77,35.58
TX
  Top 0.61: U1.35 66.69,38.12 67.94,39.37 67.94,43.81 69.22,45.09 USB.2
VCC
  Bottom 1.016: SUPPLY.1 2.69,65.41 | 2.69,65.41 2.69,31.9 1.91,31.11 1.91,10.16 3.81,8.26 6.35,8.26 C1.+ 10.16,6.99 15.62,1.52 23.11,1.52 24.13,2.54 24.13,7.36 IC2.1 | 2.69,65.41 5.23,62.87 12.7,62.87 | 12.7,62.87 14.75,60.81 D10.C 14.75,56.02 | K5.P 14.75,56.02 | 14.75,56.02 18.65,56.02 K5.1 | 12.7,62.87 33.02,62.87 | D9.C 34.44,61.45 33.02,62.87 | K4.P 34.29,55.88 34.29,58.91 D9.C | D9.C 36.2,59.05 38.35,56.9 K4.1 | 33.02,62.87 52.7,62.87 | D8.C 54.12,61.45 52.7,62.87 | D8.C 57.15,59.05 58.04,58.17 K3.1 | D8.C 54.12,56.02 K3.P | 52.7,62.87 71.75,62.87 | D2.C 73.17,61.45 71.75,62.87 | D2.C 75.56,59.05 77.09,57.53 K2.1 | D2.C 73.17,56.02 K2.P | 71.75,62.87 90.17,62.87 92.22,60.81 D1.C | D1.C 95.25,59.05 96.14,58.17 K1.1 | D1.C 92.22,56.02 K1.P

### Text on the board
bNames: SMART HOME v1.1 | A. KRUSZYNSKI | C.KULCZYK